# EAGLE schematic BasePCB (EAGLE 9.5.1)
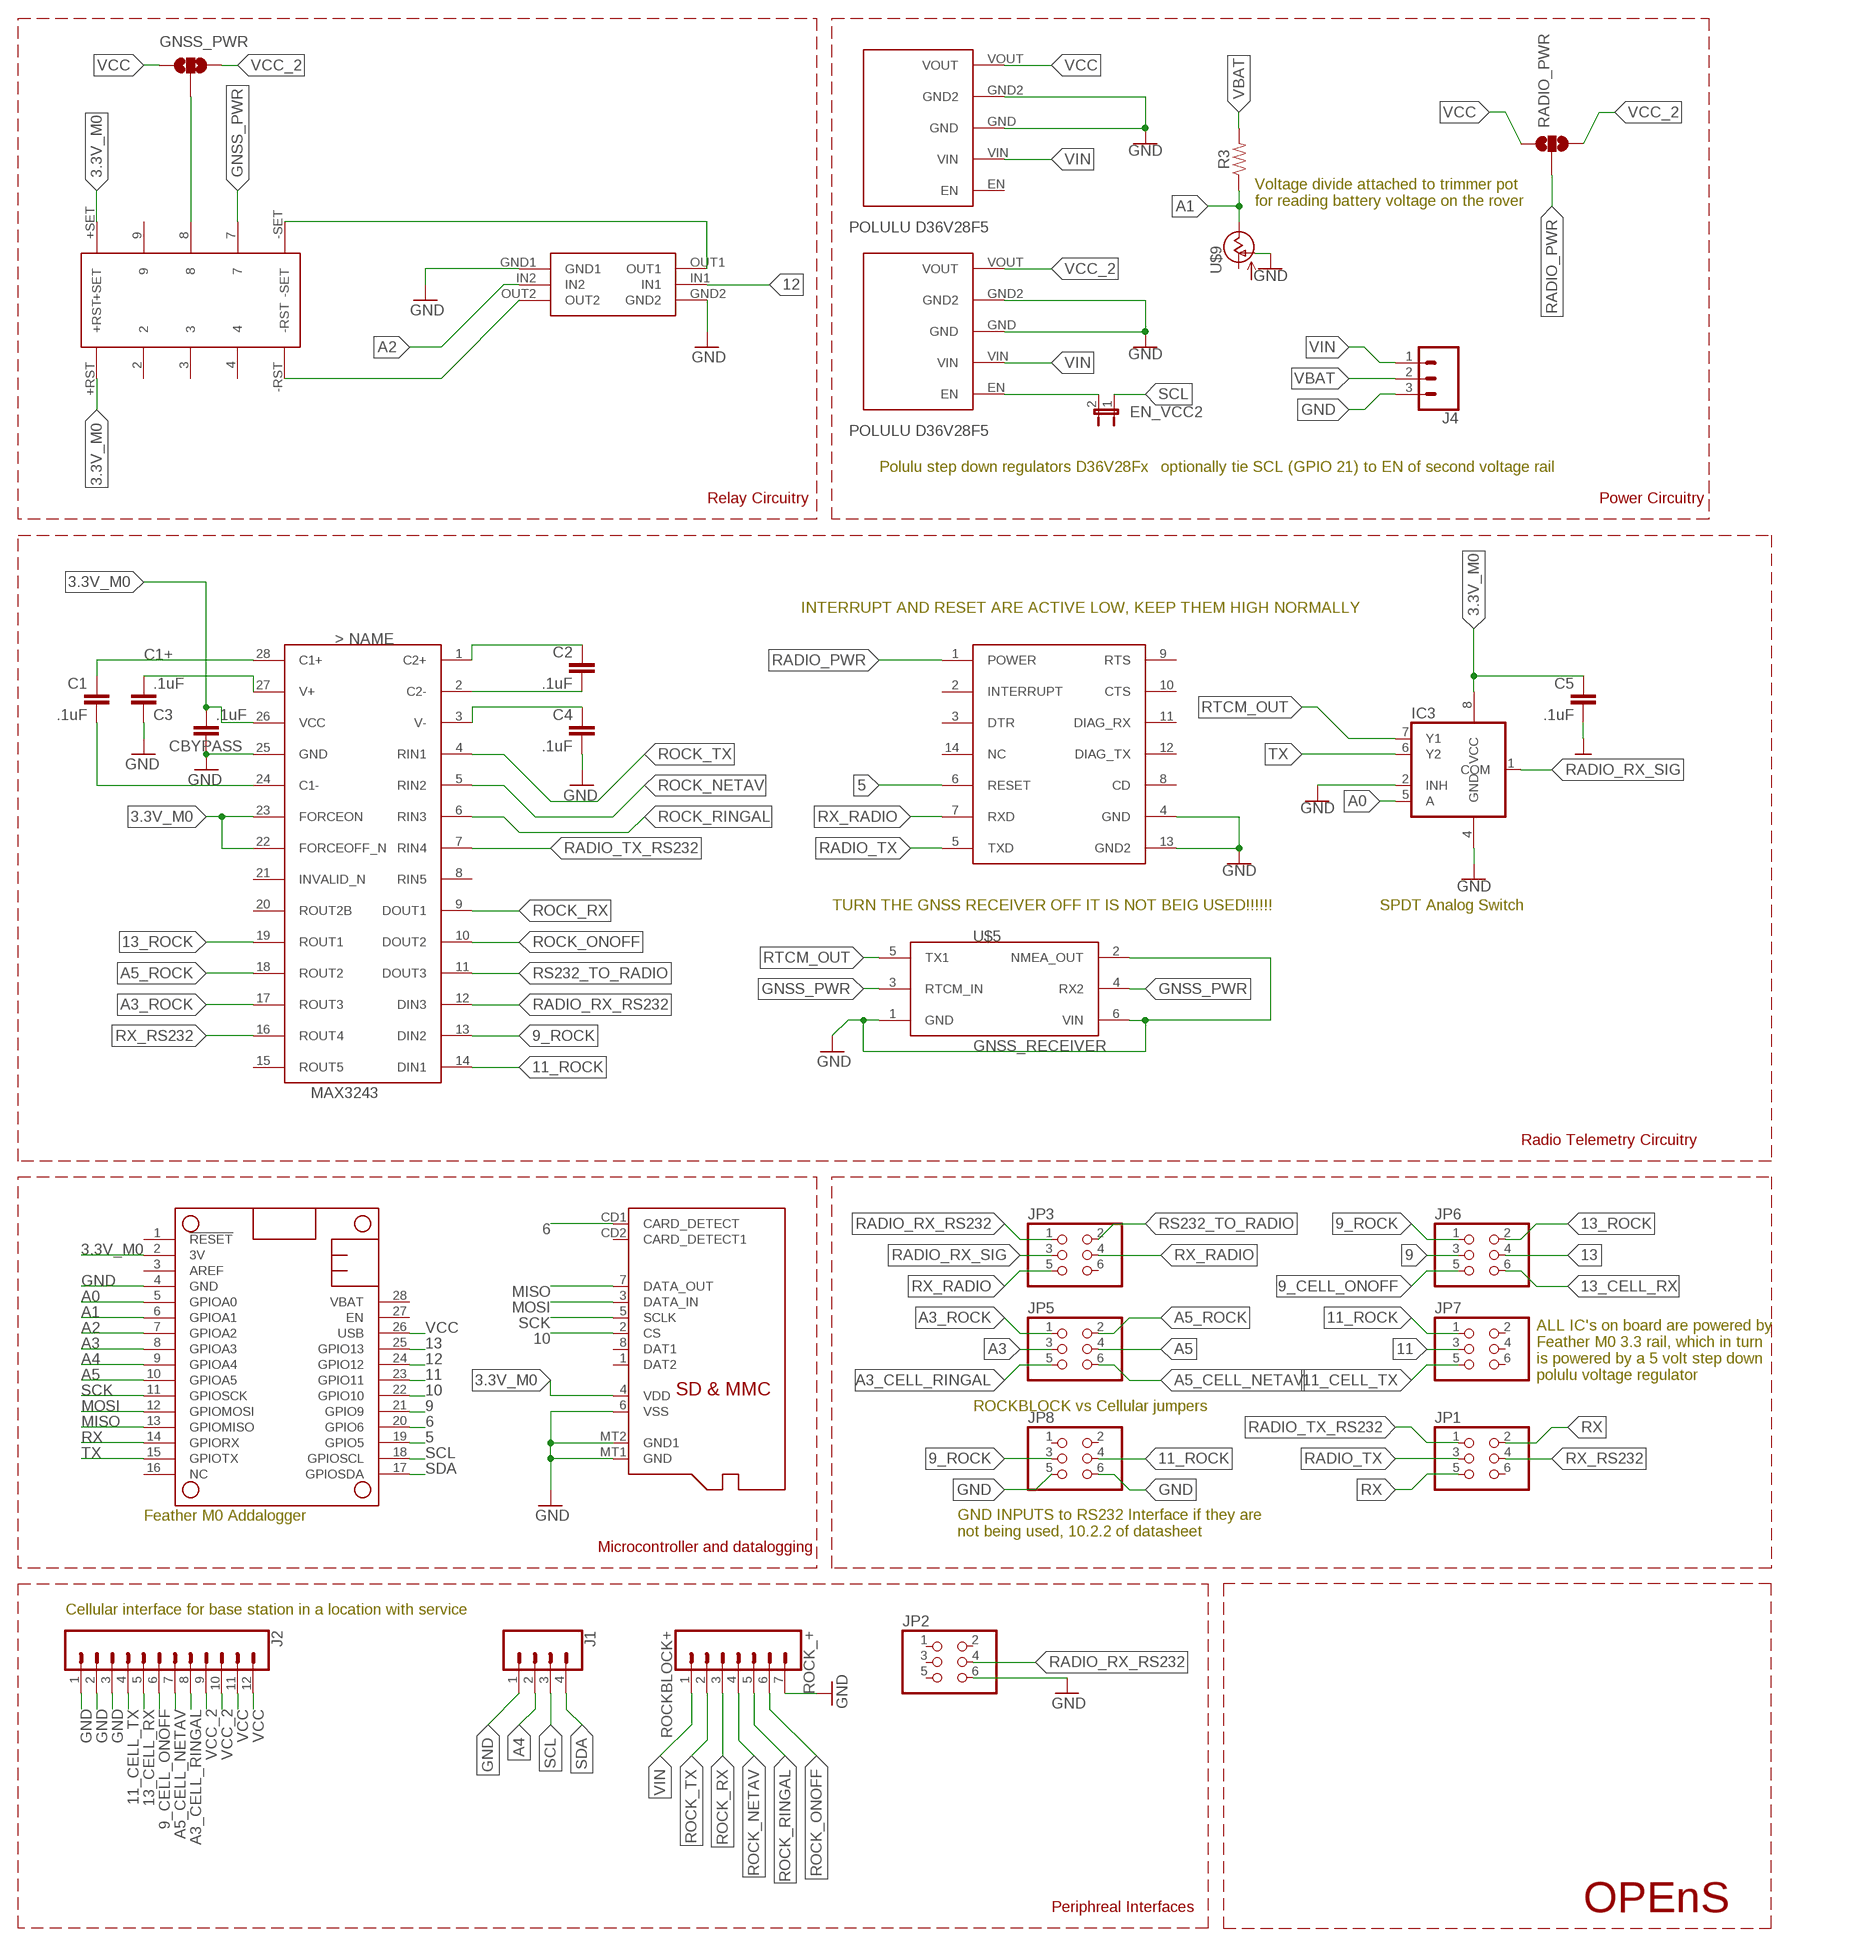
[diagram p0: schematic, sheet 1]

## Parts
C1  .1uF  CC1206  [C1206]
C2  .1uF  CC1206  [C1206]
C3  .1uF  CC1206  [C1206]
C4  .1uF  CC1206  [C1206]
C5  .1uF  CC1206  [C1206]
CBYPASS  .1uF  CC1206  [C1206]
EN_VCC2  JP1E  [JP1]
GNSS_PWR  SOLDERJUMPER_2WAY-OLDT  [SJ_2]
IC3  741G53DCT  [DCT_R-PDSO-G8]
J1  CONN_04  [1X04]
J2  CONN_12  [1X12]
J4  CONN_03SCREW  [SCREWTERMINAL-3.5MM-3]
JP1  PINHD-2X3  [2X03]
JP2  PINHD-2X3  [2X03]
JP3  PINHD-2X3  [2X03]
JP5  PINHD-2X3  [2X03]
JP6  PINHD-2X3  [2X03]
JP7  PINHD-2X3  [2X03]
JP8  PINHD-2X3  [2X03]
MS1  FEATHERWING  [FEATHERWING]
R3  1.6KOHM-0603-1/10W-1%  [0603]
RADIO_PWR  SOLDERJUMPER_2WAY-OLDT  [SJ_2]
ROCK_+  ROCKBLOCK+  CONN_073.5MM-7  [SCREWTERMINAL-3.5MM-7]
U$1  MAX3243  [SSOP-28]
U$2  OPENS-LOGO  [OPENS-LOGO]
U$3  POLULU_D36V28FX  [POLULU_D36V28FX]
U$4  MICROSD  [MICROSD]
U$5  GNSS_RECEIVER  [HDRV6W64P254_2X3_1016X508X838B]
U$7  DRDC3105  [SOT26]
U$8  TQ2SS  [TQ2SS]
U$9  CT6EP205  [CT6]
U$11  Z9-T/Z9-C  [Z9-T/Z9-C]
U$12  POLULU_D36V28FX  [POLULU_D36V28FX]

## Nets
3.3V_M0 [Power2]: C5.1 CBYPASS.2 IC3.8(VCC) MS1.2(3V) U$1.22(FORCEOFF_N) U$1.23(FORCEON) U$1.26(VCC) U$4.4(VDD) U$8.+RST U$8.+SET
5: MS1.19(GPIO5) U$11.6(RESET)
6: MS1.20(GPIO6) U$4.CD1(CARD_DETECT)
9: JP6.3 MS1.21(GPIO9)
9_CELL_ONOFF: J2.6 JP6.5
9_ROCK: JP6.1 JP8.3 U$1.13(DIN2)
10: MS1.22(GPIO10) U$4.2(CS)
11: JP7.3 MS1.23(GPIO11)
11_CELL_TX: J2.4 JP7.5
11_ROCK: JP7.1 JP8.4 U$1.14(DIN1)
12: MS1.24(GPIO12) U$7.IN1
13: JP6.4 MS1.25(GPIO13)
13_CELL_RX: J2.5 JP6.6
13_ROCK: JP6.2 U$1.19(ROUT1)
A0: IC3.5(A) MS1.5(GPIOA0)
A1: MS1.6(GPIOA1) R3.1 U$9.S(VSS)
A2: MS1.7(GPIOA2) U$7.IN2
A3: JP5.3 MS1.8(GPIOA3)
A3_CELL_RINGAL: J2.8 JP5.5
A3_ROCK: JP5.1 U$1.17(ROUT3)
A4: J1.2 MS1.9(GPIOA4)
A5: JP5.4 MS1.10(GPIOA5)
A5_CELL_NETAV: J2.7 JP5.6
A5_ROCK: JP5.2 U$1.18(ROUT2)
C1+: C1.1 U$1.28(C1+)
GND: C3.1 C4.2 C5.2 CBYPASS.1 IC3.2(INH) IC3.4(GND) J1.1 J2.1 J2.2 J2.3 J4.3 JP2.6 JP8.5 JP8.6 MS1.4(GND) ROCK_+.7 U$1.25(GND) U$3.GND U$3.GND2 U$4.6(VSS) U$4.MT1(GND) U$4.MT2(GND1) U$5.1(GND) U$5.2(NMEA_OUT) U$5.6(VIN) U$7.GND1 U$7.GND2 U$9.A(OUT) U$11.4(GND) U$11.13(GND2) U$12.GND U$12.GND2
GNSS_PWR: U$5.3(RTCM_IN) U$5.4(RX2) U$8.7
MISO: MS1.13(GPIOMISO) U$4.7(DATA_OUT)
MOSI: MS1.12(GPIOMOSI) U$4.3(DATA_IN)
N$1 [Power]: GNSS_PWR.2 U$8.8
N$4: C2.1 U$1.1(C2+)
N$5: C2.2 U$1.2(C2-)
N$7: U$7.OUT2 U$8.-RST
N$8: U$7.OUT1 U$8.-SET
N$9: EN_VCC2.2 U$12.EN
N$10: C4.1 U$1.3(V-)
N$11: C1.2 U$1.24(C1-)
N$13: C3.2 U$1.27(V+)
RADIO_PWR [Power]: RADIO_PWR.2 U$11.1(POWER)
RADIO_RX_RS232: JP2.4 JP3.1 U$1.12(DIN3)
RADIO_RX_SIG: IC3.1(COM) JP3.3
RADIO_TX: JP1.3 U$11.5(TXD)
RADIO_TX_RS232: JP1.1 U$1.7(RIN4)
ROCK_NETAV: ROCK_+.4 U$1.5(RIN2)
ROCK_ONOFF: ROCK_+.6 U$1.10(DOUT2)
ROCK_RINGAL: ROCK_+.5 U$1.6(RIN3)
ROCK_RX: ROCK_+.3 U$1.9(DOUT1)
ROCK_TX: ROCK_+.2 U$1.4(RIN1)
RS232_TO_RADIO: JP3.2 U$1.11(DOUT3)
RTCM_OUT: IC3.7(Y1) U$5.5(TX1)
RX: JP1.2 JP1.5 MS1.14(GPIORX)
RX_RADIO: JP3.4 JP3.5 U$11.7(RXD)
RX_RS232: JP1.4 U$1.16(ROUT4)
SCK: MS1.11(GPIOSCK) U$4.5(SCLK)
SCL: EN_VCC2.1 J1.3 MS1.18(GPIOSCL)
SDA: J1.4 MS1.17(GPIOSDA)
TX: IC3.6(Y2) MS1.15(GPIOTX)
VBAT: J4.2 R3.2
VCC [Power]: GNSS_PWR.1 J2.11 J2.12 MS1.26(USB) RADIO_PWR.1 U$3.VOUT
VCC_2 [Power]: GNSS_PWR.3 J2.9 J2.10 RADIO_PWR.3 U$12.VOUT
VIN [Power]: J4.1 ROCK_+.1 U$3.VIN U$12.VIN
Unconnected: JP1.6 JP2.1 JP2.2 JP2.3 JP2.5 JP3.6 JP7.2 JP7.4 JP7.6 JP8.1 JP8.2 MS1.1(!RESET) MS1.3(AREF) MS1.16(NC) MS1.27(EN) MS1.28(VBAT) U$1.8(RIN5) U$1.15(ROUT5) U$1.20(ROUT2B) U$1.21(INVALID_N) U$3.EN U$4.1(DAT2) U$4.8(DAT1) U$4.CD2(CARD_DETECT1) U$8.2 U$8.3 U$8.4 U$8.9 U$9.E(VDD) U$11.2(INTERRUPT) U$11.3(DTR) U$11.8(CD) U$11.9(RTS) U$11.10(CTS) U$11.11(DIAG_RX) U$11.12(DIAG_TX) U$11.14(NC)

## Notes on the sheet
- Voltage divide attached to trimmer pot 
  for reading battery voltage on the rover
- Polulu step down regulators D36V28Fx | optionally tie SCL (GPIO 21) to EN of second voltage rail
- Relay Circuitry | Power Circuitry
- INTERRUPT AND RESET ARE ACTIVE LOW, KEEP THEM HIGH NORMALLY
- TURN THE GNSS RECEIVER OFF IT IS NOT BEIG USED!!!!!! | SPDT Analog Switch
- Radio Telemetry Circuitry
- ALL IC's on board are powered by 
  Feather M0 3.3 rail, which in turn 
  is powered by a 5 volt step down 
  polulu voltage regulator
- ROCKBLOCK vs Cellular jumpers
- Feather M0 Addalogger
- GND INPUTS to RS232 Interface if they are
  not being used, 10.2.2 of datasheet
- Microcontroller and datalogging
- Cellular interface for base station in a location with service
- Periphreal Interfaces

## Library data of the parts
C1-C5 CBYPASS = eagle-ltspice:C: CAPACITOR, European symbol; SPICEMODEL: NONE; SPICEPREFIX: C
EN_VCC2 = jumper:JP1E: JUMPER
GNSS_PWR RADIO_PWR = SparkFun-Retired:SOLDERJUMPER_2WAY-OLD: Solder Jumper 2 way solder jumper
IC3 = 74xx-little-de:74*1G53: SINGLE-POLE DOUBLE-THROW (SPDT) ANALOG SWITCH 2:1 ANALOG MULTIPLEXER/DEMULTIPLEXER Source: http://focus.ti.com/lit/ds/symlink/sn74lvc2g53.pdf
J1 = SparkFun-Connectors:CONN_04: Multi connection point. Often used as Generic Header-pin footprint for 0.1 inch spaced/style header connections On any of the 0.1 inch spaced packages, you can populate with these: Break Away Headers - Straight <https://www.sparkfun.com/products/116> (PRT-00116) Break Away Male Headers - Right Angle <https://www.sparkfun.com/products/553> (PRT-00553) Female Headers <https://www.sparkfun.com/products/115> (PRT-00115) Break Away Headers - Machine Pin <https://www.sparkfun.com/products/117> (PRT-00117) Break Away Female Headers - Swiss Machine Pin <https://www.sparkfun.com/products/743> (PRT-00743) For SCREWTERMINALS and SPRING TERMINALS visit here: Screw Terimnals on SparkFun.com <https://www.sparkfun.com/search/results?term=Screw+Terminals> (5mm/3.5mm/2.54mm spacing) This device is also useful as a general connection point to wire up your design to another part of your project. Our various solder wires solder well into these plated through hole pads. Hook-Up Wire - Assortment (Stranded, 22 AWG) <https://www.sparkfun.com/products/11375> (PRT-11375) Hook-Up Wire - Assortment (Solid Core, 22 AWG) <https://www.sparkfun.com/products/11367> (PRT-11367) View the entire wire category on our website here <https://www.sparkfun.com/categories/141> Special notes: Molex polarized connector foot print use with SKU : PRT-08231 with associated crimp pins and housings. 1MM SMD Version SKU: PRT-10208; PROD_ID: CONN-09696
J2 = SparkFun-Connectors:CONN_12: Multi connection point. Often used as Generic Header-pin footprint for 0.1 inch spaced/style header connections On any of the 0.1 inch spaced packages, you can populate with these: Break Away Headers - Straight <https://www.sparkfun.com/products/116> (PRT-00116) Break Away Male Headers - Right Angle <https://www.sparkfun.com/products/553> (PRT-00553) Female Headers <https://www.sparkfun.com/products/115> (PRT-00115) Break Away Headers - Machine Pin <https://www.sparkfun.com/products/117> (PRT-00117) Break Away Female Headers - Swiss Machine Pin <https://www.sparkfun.com/products/743> (PRT-00743) For SCREWTERMINALS and SPRING TERMINALS visit here: Screw Terimnals on SparkFun.com <https://www.sparkfun.com/search/results?term=Screw+Terminals> (5mm/3.5mm/2.54mm spacing) This device is also useful as a general connection point to wire up your design to another part of your project. Our various solder wires solder well into these plated through hole pads. Hook-Up Wire - Assortment (Stranded, 22 AWG) <https://www.sparkfun.com/products/11375> (PRT-11375) Hook-Up Wire - Assortment (Solid Core, 22 AWG) <https://www.sparkfun.com/products/11367> (PRT-11367) View the entire wire category on our website here <https://www.sparkfun.com/categories/141> Special notes: Molex polarized connector foot print use with SKU : PRT-08231 with associated crimp pins and housings. 1MM SMD Version SKU: PRT-10208 NOTES ON THE VARIANTS LOCK and LOCK_LONGPADS... This footprint was designed to help hold the alignment of a through-hole component (i.e. 6-pin header) while soldering it into place. You may notice that each hole has been shifted either up or down by 0.005 of an inch from it's more standard position (which is a perfectly straight line). This slight alteration caused the pins (the squares in the middle) to touch the edges of the holes. Because they are alternating, it causes a "brace" to hold the component in place. 0.005 has proven to be the perfect amount of "off-center" position when using our standard breakaway headers. Although looks a little odd when you look at the bare footprint, once you have a header in there, the alteration is very hard to notice. Also,if you push a header all the way into place, it is covered up entirely on the bottom side.
J4 = SparkFun-Connectors:CONN_03: Multi connection point. Often used as Generic Header-pin footprint for 0.1 inch spaced/style header connections On any of the 0.1 inch spaced packages, you can populate with these: Break Away Headers - Straight <https://www.sparkfun.com/products/116> (PRT-00116) Break Away Male Headers - Right Angle <https://www.sparkfun.com/products/553> (PRT-00553) Female Headers <https://www.sparkfun.com/products/115> (PRT-00115) Break Away Headers - Machine Pin <https://www.sparkfun.com/products/117> (PRT-00117) Break Away Female Headers - Swiss Machine Pin <https://www.sparkfun.com/products/743> (PRT-00743) Stackable Header - 3 Pin (Female, 0.1") <https://www.sparkfun.com/products/13875> (PRT-13875) For SCREWTERMINALS and SPRING TERMINALS visit here: Screw Terimnals on SparkFun.com <https://www.sparkfun.com/search/results?term=Screw+Terminals> (5mm/3.5mm/2.54mm spacing) This device is also useful as a general connection point to wire up your design to another part of your project. Our various solder wires solder well into these plated through hole pads. Hook-Up Wire - Assortment (Stranded, 22 AWG) <https://www.sparkfun.com/products/11375> (PRT-11375) Hook-Up Wire - Assortment (Solid Core, 22 AWG) <https://www.sparkfun.com/products/11367> (PRT-11367) View the entire wire category on our website here <https://www.sparkfun.com/categories/141> Special notes: Molex polarized connector foot print use with SKU : PRT-08232 with associated crimp pins and housings.; PROD_ID: CONN-08288; SF_ID: PRT-08235
JP1-JP3 JP5-JP8 = pinhead:PINHD-2X3: PIN HEADER
MS1 = adafruit:FEATHERWING
R3 = SparkFun-Resistors:1.6KOHM: 1.6kΩ resistor A resistor is a passive two-terminal electrical component that implements electrical resistance as a circuit element. Resistors act to reduce current flow, and, at the same time, act to lower voltage levels within circuits. - Wikipedia; PROD_ID: RES-08361; VALUE: 1.6k
ROCK_+ = SparkFun-Connectors:CONN_07: Multi connection point. Often used as Generic Header-pin footprint for 0.1 inch spaced/style header connections On any of the 0.1 inch spaced packages, you can populate with these: Break Away Headers - Straight <https://www.sparkfun.com/products/116> (PRT-00116) Break Away Male Headers - Right Angle <https://www.sparkfun.com/products/553> (PRT-00553) Female Headers <https://www.sparkfun.com/products/115> (PRT-00115) Break Away Headers - Machine Pin <https://www.sparkfun.com/products/117> (PRT-00117) Break Away Female Headers - Swiss Machine Pin <https://www.sparkfun.com/products/743> (PRT-00743) For SCREWTERMINALS and SPRING TERMINALS visit here: Screw Terimnals on SparkFun.com <https://www.sparkfun.com/search/results?term=Screw+Terminals> (5mm/3.5mm/2.54mm spacing) This device is also useful as a general connection point to wire up your design to another part of your project. Our various solder wires solder well into these plated through hole pads. Hook-Up Wire - Assortment (Stranded, 22 AWG) <https://www.sparkfun.com/products/11375> (PRT-11375) Hook-Up Wire - Assortment (Solid Core, 22 AWG) <https://www.sparkfun.com/products/11367> (PRT-11367) View the entire wire category on our website here <https://www.sparkfun.com/categories/141> Special notes: Molex polarized connector foot print use with SKU : PRT-08231 with associated crimp pins and housings. 1MM SMD Version SKU: PRT-10208 NOTES ON THE VARIANTS LOCK and LOCK_LONGPADS... This footprint was designed to help hold the alignment of a through-hole component (i.e. 6-pin header) while soldering it into place. You may notice that each hole has been shifted either up or down by 0.005 of an inch from it's more standard position (which is a perfectly straight line). This slight alteration caused the pins (the squares in the middle) to touch the edges of the holes. Because they are alternating, it causes a "brace" to hold the component in place. 0.005 has proven to be the perfect amount of "off-center" position when using our standard breakaway headers. Although looks a little odd when you look at the bare footprint, once you have a header in there, the alteration is very hard to notice. Also,if you push a header all the way into place, it is covered up entirely on the bottom side.
U$1 = ftdi4:MAX3243: MAX3243 RS232 interface 5 receive lines 3 line drives 5V or 3.3V operating voltage
U$2 = opens-logo:OPENS-LOGO: OPENS Lab Logo
U$3 U$12 = SlideSentinel:POLULU_D36V28FX
U$4 = adafruit:MICROSD: Micro-SD / Transflash card holder with SPI pinout For the 3M # 2908-05WB-MG and/or 4UCON #19656 push-push type
U$5 = SlideSentinel:GNSS_RECEIVER
U$7 = SlideSentinel:DRDC3105
U$8 = SlideSentinel:TQ2SS
U$9 = tango:CT6EP205
U$11 = SlideSentinel:Z9-T/Z9-C

## Net classes
0 default: width 0.203 mm, drill 0.203 mm, clearance 0.203 mm
1 Power: width 0.635 mm, drill 1.27 mm, clearance 0.203 mm
2 Power2: width 0.457 mm, drill 0.457 mm, clearance 0.203 mm